# EAGLE design 6packRev1B (EAGLE 9.2.0)
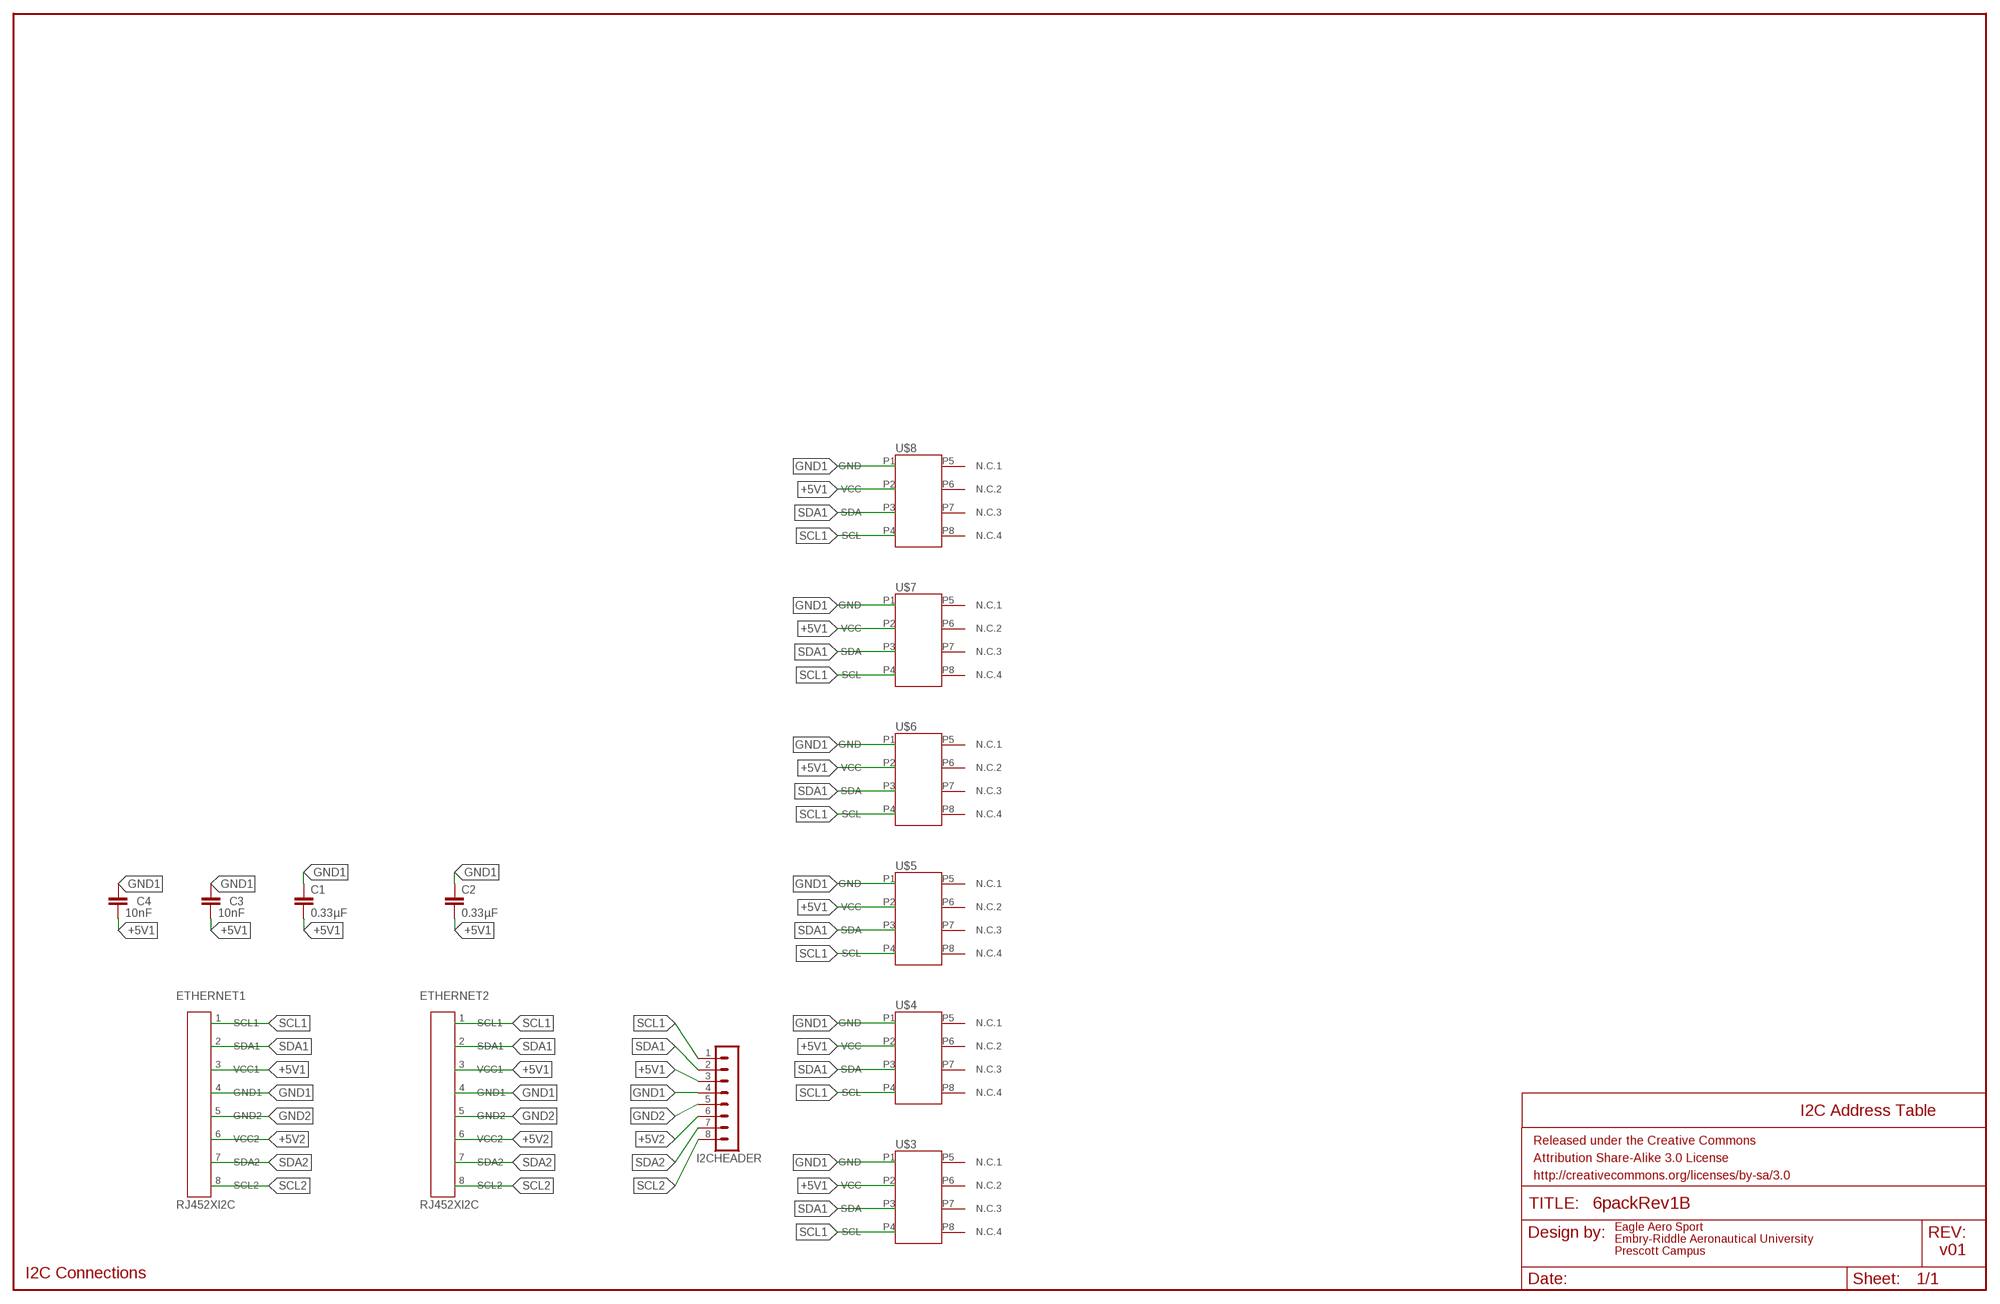
[diagram p0: schematic, sheet 1]

## Parts
C1  0.33µF  0.33UF/330NF-0805-50V-10%  [0805]
C2  0.33µF  0.33UF/330NF-0805-50V-10%  [0805]
C3  10nF  10NF-PTH-10MM-10000V-1-%  [CAP-PTH-10MM]
C4  10nF  10NF-PTH-10MM-10000V-1-%  [CAP-PTH-10MM]
ETHERNET1  RJ452XI2C  [RJ45-8]
ETHERNET2  RJ452XI2C  [RJ45-8]
FRAME1  FRAME-LEDGER  [CREATIVE_COMMONS]
I2CHEADER  MA08-1  [MA08-1]
U$3  AMS5915  [DIP8W]
U$4  AMS5915  [DIP8W]
U$5  AMS5915  [DIP8W]
U$6  AMS5915  [DIP8W]
U$7  AMS5915  [DIP8W]
U$8  AMS5915  [DIP8W]

## Nets
+5V1: C1.2 C2.2 C3.2 C4.2 ETHERNET1.3(VCC1) ETHERNET2.3(VCC1) I2CHEADER.3 U$3.P2(VCC) U$4.P2(VCC) U$5.P2(VCC) U$6.P2(VCC) U$7.P2(VCC) U$8.P2(VCC)
+5V2: ETHERNET1.6(VCC2) ETHERNET2.6(VCC2) I2CHEADER.6
GND1: C1.1 C2.1 C3.1 C4.1 ETHERNET1.4(GND1) ETHERNET2.4(GND1) I2CHEADER.4 U$3.P1(GND) U$4.P1(GND) U$5.P1(GND) U$6.P1(GND) U$7.P1(GND) U$8.P1(GND)
GND2: ETHERNET1.5(GND2) ETHERNET2.5(GND2) I2CHEADER.5
SCL1: ETHERNET1.1(SCL1) ETHERNET2.1(SCL1) I2CHEADER.1 U$3.P4(SCL) U$4.P4(SCL) U$5.P4(SCL) U$6.P4(SCL) U$7.P4(SCL) U$8.P4(SCL)
SCL2: ETHERNET1.8(SCL2) ETHERNET2.8(SCL2) I2CHEADER.8
SDA1: ETHERNET1.2(SDA1) ETHERNET2.2(SDA1) I2CHEADER.2 U$3.P3(SDA) U$4.P3(SDA) U$5.P3(SDA) U$6.P3(SDA) U$7.P3(SDA) U$8.P3(SDA)
SDA2: ETHERNET1.7(SDA2) ETHERNET2.7(SDA2) I2CHEADER.7
Unconnected: U$3.P5(N.C.1) U$3.P6(N.C.2) U$3.P7(N.C.3) U$3.P8(N.C.4) U$4.P5(N.C.1) U$4.P6(N.C.2) U$4.P7(N.C.3) U$4.P8(N.C.4) U$5.P5(N.C.1) U$5.P6(N.C.2) U$5.P7(N.C.3) U$5.P8(N.C.4) U$6.P5(N.C.1) U$6.P6(N.C.2) U$6.P7(N.C.3) U$6.P8(N.C.4) U$7.P5(N.C.1) U$7.P6(N.C.2) U$7.P7(N.C.3) U$7.P8(N.C.4) U$8.P5(N.C.1) U$8.P6(N.C.2) U$8.P7(N.C.3) U$8.P8(N.C.4)

## Notes on the sheet
- I2C Address Table
- Eagle Aero Sport
  Embry-Riddle Aeronautical University
  Prescott Campus
- v01
- I2C Connections

## Library data of the parts
C1 C2 = SparkFun-Capacitors:0.33UF/330NF: 0.33µF/330nF ceramic capacitors A capacitor is a passive two-terminal electrical component used to store electrical energy temporarily in an electric field.; PROD_ID: CAP-08469
C3 C4 = SparkFun-Capacitors:10NF: 0.01uF/10nF/10,000pF ceramic capacitors A capacitor is a passive two-terminal electrical component used to store electrical energy temporarily in an electric field. CAP-09321; PROD_ID: CAP-09321
ETHERNET1 ETHERNET2 = untitled:RJ452XI2C
FRAME1 = SparkFun-Aesthetics:FRAME-LEDGER: Schematic Frame Standard 11x14 US Ledger frame
I2CHEADER = con-lstb:MA08-1: PIN HEADER; OC_FARNELL: unknown; OC_NEWARK: unknown
U$3-U$8 = untitled:AMS5915

## Net classes
0 default: width 0.305 mm, clearance 0.762 mm

## Board
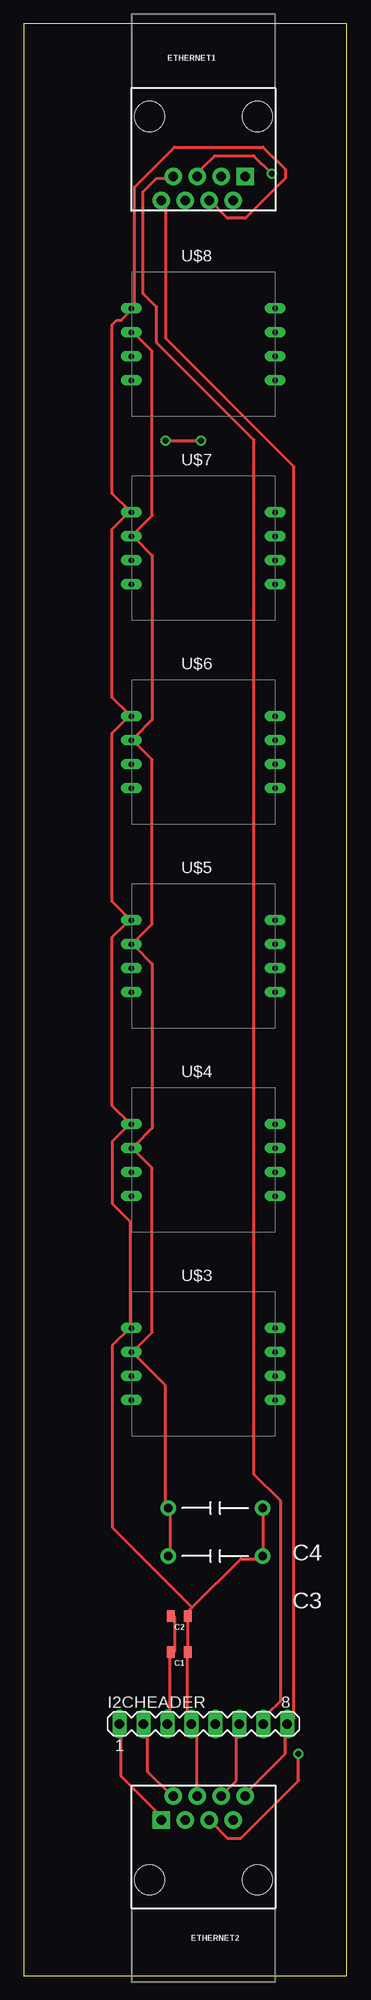
[diagram p1: board, top side]
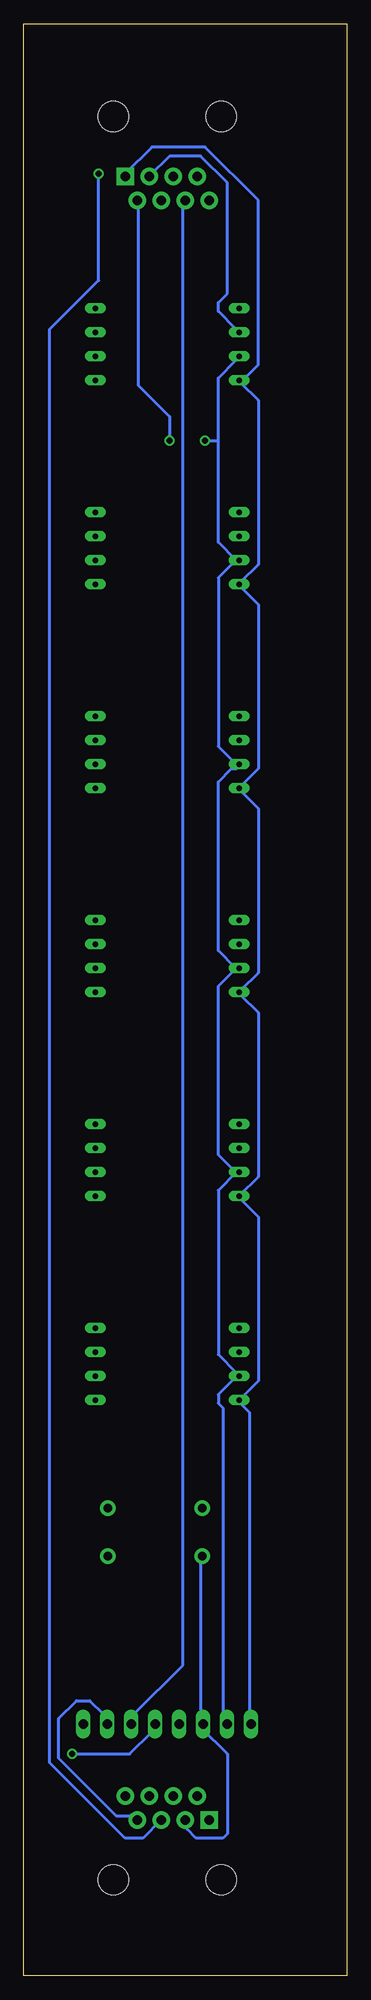
[diagram p2: board, bottom side, seen from below]

Size 34.27 x 206.68 mm. Coordinates in mm from the lower left corner, seen from the top.
Outline: 0,0 34.27,0 34.27,206.68 0,206.68 0,0
Copper layers (1*16): Top 0.035mm / dielectric 1.5mm / Bottom 0.035mm
Design rules "default": minimum track width 6mil, minimum drill 0.35mm, track to track 6mil, track to pad 6mil, pad to pad 6mil, via to via 6mil, smd to smd 6mil, copper to edge 40mil, drill to drill 6mil, minimum pad ring 10mil, minimum via ring 8mil, stop-mask expansion 4mil, vias tented up to drill 0mil, thermal gap 10mil

### Footprints (pad centres in the part's own frame; a part is rotated, then mirrored left to right if it is on the bottom)
0805 = smd 0.8 x 1.2: 1 -0.9,0; 2 0.9,0
CAP-PTH-10MM = drill 0.9 pad 1.651: 1 -5,0; 2 5,0
RJ45-8 = drill 1 pad 1.88 square: 1 -4.445,6.35 | drill 1 pad 1.88: 2 -3.175,8.89; 3 -1.905,6.35; 4 -0.635,8.89; 5 0.635,6.35; 6 1.905,8.89; 7 3.175,6.35; 8 4.445,8.89 | hole 3.2: -5.715,0; 5.715,0
MA08-1 = drill 1.016 long: 1 -8.89,0; 2 -6.35,0; 3 -3.81,0; 4 -1.27,0; 5 1.27,0; 6 3.81,0; 7 6.35,0; 8 8.89,0
DIP8W = drill 0.6 long: P1 -7.62,3.81; P2 -7.62,1.27; P3 -7.62,-1.27; P4 -7.62,-3.81; P5 7.62,-3.81; P6 7.62,-1.27; P7 7.62,1.27; P8 7.62,3.81

### Placement (x,y rotation side)
C1  16.51,34.29 180 top
C2  16.51,38.1 180 top
C3  20.32,44.45 180 top
C4  20.32,49.53 180 top
ETHERNET1  19.05,196.85 180 top
ETHERNET2  19.05,10.16 0 top
FRAME1  -77.47,72.39 0 top  (outside the outline)
I2CHEADER  19.05,26.67 0 top
U$3  19.05,64.77 0 top
U$4  19.05,86.36 0 top
U$5  19.05,107.95 0 top
U$6  19.05,129.54 0 top
U$7  19.05,151.13 0 top
U$8  19.05,172.72 0 top

### Tracks (layer width: path | path; a pad name or v marks a point on that pad's centre or on a via)
+5V1
  Top 0.305: U$8.P2 11.75,173.86 13.63,171.98 13.63,154.6 U$7.P2 11.75,152.25 13.63,150.37 13.63,132.98 11.75,131.1 U$6.P2 11.75,130.63 13.63,128.75 13.63,111.37 11.75,109.49 U$5.P2 11.75,109.02 13.63,107.14 13.63,89.75 11.75,87.87 U$4.P2 11.75,87.4 13.63,85.52 13.63,68.14 11.75,66.26 U$3.P2 11.75,65.79 15.04,62.5 15.04,49.81 C4.2 15.51,49.34 15.51,44.64 C3.2 | C2.2 15.98,38.06 15.98,34.3 C1.2 15.51,33.83 15.51,26.78 I2CHEADER.3
  Bottom 0.305: ETHERNET1.3 18.8,192.66 15.51,192.66 12.69,189.84 12.69,178.09 13.63,177.15 13.63,176.21 11.75,174.33 U$8.P2 | ETHERNET2.3 16.92,16.45 16.92,15.51 15.98,14.57 13.16,14.57 12.69,15.04 12.69,23.5 15.51,26.31 I2CHEADER.3 15.51,26.78 15.51,44.17 C3.2
+5V2
  Top 0.305: I2CHEADER.6 22.55,26.31 22.55,20.68 21.14,19.27 ETHERNET2.6
  Bottom 0.305: ETHERNET1.6 17.39,187.96 17.39,32.89 22.55,27.72 22.55,26.78 I2CHEADER.6
GND1
  Top 0.305: C4.1 25.38,49.34 25.38,44.64 C3.1 24.91,44.17 23.02,44.17 17.86,39 | ETHERNET2.4 18.33,19.27 18.33,25.84 17.86,26.31 I2CHEADER.4 17.39,26.78 17.39,33.83 C1.1 17.39,34.3 17.39,38.06 C2.1 17.39,38.53 17.86,39 | 11.28,68.61 11.28,79.88 9.4,81.76 9.4,88.34 11.28,90.22 | 11.28,90.22 9.4,92.1 9.4,109.96 10.81,111.37 11.28,111.37 U$5.P1 11.28,111.84 9.4,113.72 9.4,131.57 10.81,132.98 11.28,132.98 U$6.P1 11.28,133.45 9.4,135.33 9.4,153.19 10.81,154.6 11.28,154.6 U$7.P1 11.28,155.07 9.4,156.95 9.4,174.8 9.87,175.27 10.34,175.27 11.28,176.21 U$8.P1 11.75,176.68 11.75,189.37 15.98,193.6 25.38,193.6 27.72,191.25 27.72,190.31 23.5,186.08 21.61,186.08 19.74,187.96 ETHERNET1.4 | 11.28,90.22 U$4.P1 | 17.86,39 9.4,47.46 9.4,66.73 11.28,68.61 | 11.28,68.61 U$3.P1
GND2  (via drill 0.64)
  Top 0.305: v29.13,23.5 29.13,20.68 23.02,14.57 21.61,14.57 19.74,16.45 ETHERNET2.5 | v26.31,190.78 24.43,192.66 20.21,192.66 18.8,191.25 18.8,190.78 ETHERNET1.5
  Bottom 0.305: v29.13,23.5 23.02,23.5 20.68,25.84 20.68,26.31 I2CHEADER.5 | v26.31,190.78 26.31,179.5 31.48,174.33 31.48,22.55 23.5,14.57 21.61,14.57 19.74,16.45 ETHERNET2.5
SCL1
  Top 0.305: I2CHEADER.1 10.34,26.31 10.34,21.14 14.57,16.92 ETHERNET2.1
  Bottom 0.305: I2CHEADER.1 10.34,26.78 10.34,59.68 11.28,60.62 U$3.P4 11.28,61.09 9.4,62.97 9.4,80.35 11.28,82.23 U$4.P4 9.4,84.58 9.4,101.97 11.28,103.85 U$5.P4 11.28,104.32 9.4,106.2 9.4,123.58 11.28,125.46 U$6.P4 11.28,125.93 9.4,127.81 9.4,145.2 11.28,147.08 U$7.P4 11.28,147.55 9.4,149.43 9.4,166.81 11.28,168.69 | 11.28,168.69 9.4,170.57 9.4,187.96 15.04,193.6 20.68,193.6 23.5,190.78 ETHERNET1.1 | 11.28,168.69 U$8.P4
SCL2
  Top 0.305: ETHERNET2.8 23.5,19.27 27.72,23.5 27.72,26.31 I2CHEADER.8 28.19,26.78 28.66,27.25 28.66,159.77 15.04,173.39 15.04,187.96 ETHERNET1.8
SDA1  (via drill 0.64)
  Top 0.305: v15.04,162.53 v18.8,162.53 | I2CHEADER.2 13.16,26.31 13.16,21.61 15.51,19.27 ETHERNET2.2
  Bottom 0.305: 11.75,149.9 13.63,148.02 13.63,130.16 11.75,128.28 U$6.P3 11.75,127.81 12.22,127.81 13.63,126.4 13.63,108.55 11.75,106.67 | 13.63,162.53 13.63,151.78 11.75,149.9 | 13.63,162.53 13.63,169.16 11.75,171.04 U$8.P3 | 11.75,149.9 U$7.P3 | v18.8,162.53 18.8,165.07 22.09,168.36 22.09,187.96 ETHERNET1.2 | v15.04,162.53 13.63,162.53 | 11.75,85.05 13.63,83.17 13.63,65.79 11.75,63.91 U$3.P3 11.75,63.44 13.63,61.56 13.63,60.62 13.16,60.15 13.16,26.78 I2CHEADER.2 | 11.75,106.67 13.63,104.79 13.63,86.93 11.75,85.05 | 11.75,85.05 U$4.P3 | 11.75,106.67 U$5.P3
SDA2
  Top 0.305: ETHERNET1.7 15.51,190.31 14.1,190.31 12.69,188.9 12.69,178.09 14.1,176.68 14.1,172.92 24.43,162.59 24.43,53.1 27.25,50.28 27.25,29.13 25.84,27.72 25.84,26.78 I2CHEADER.7
  Bottom 0.305: I2CHEADER.7 25.84,26.78 25.84,27.72 27.25,29.13 28.66,29.13 30.54,27.25 30.54,23.02 24.43,16.92 22.55,16.92 ETHERNET2.7